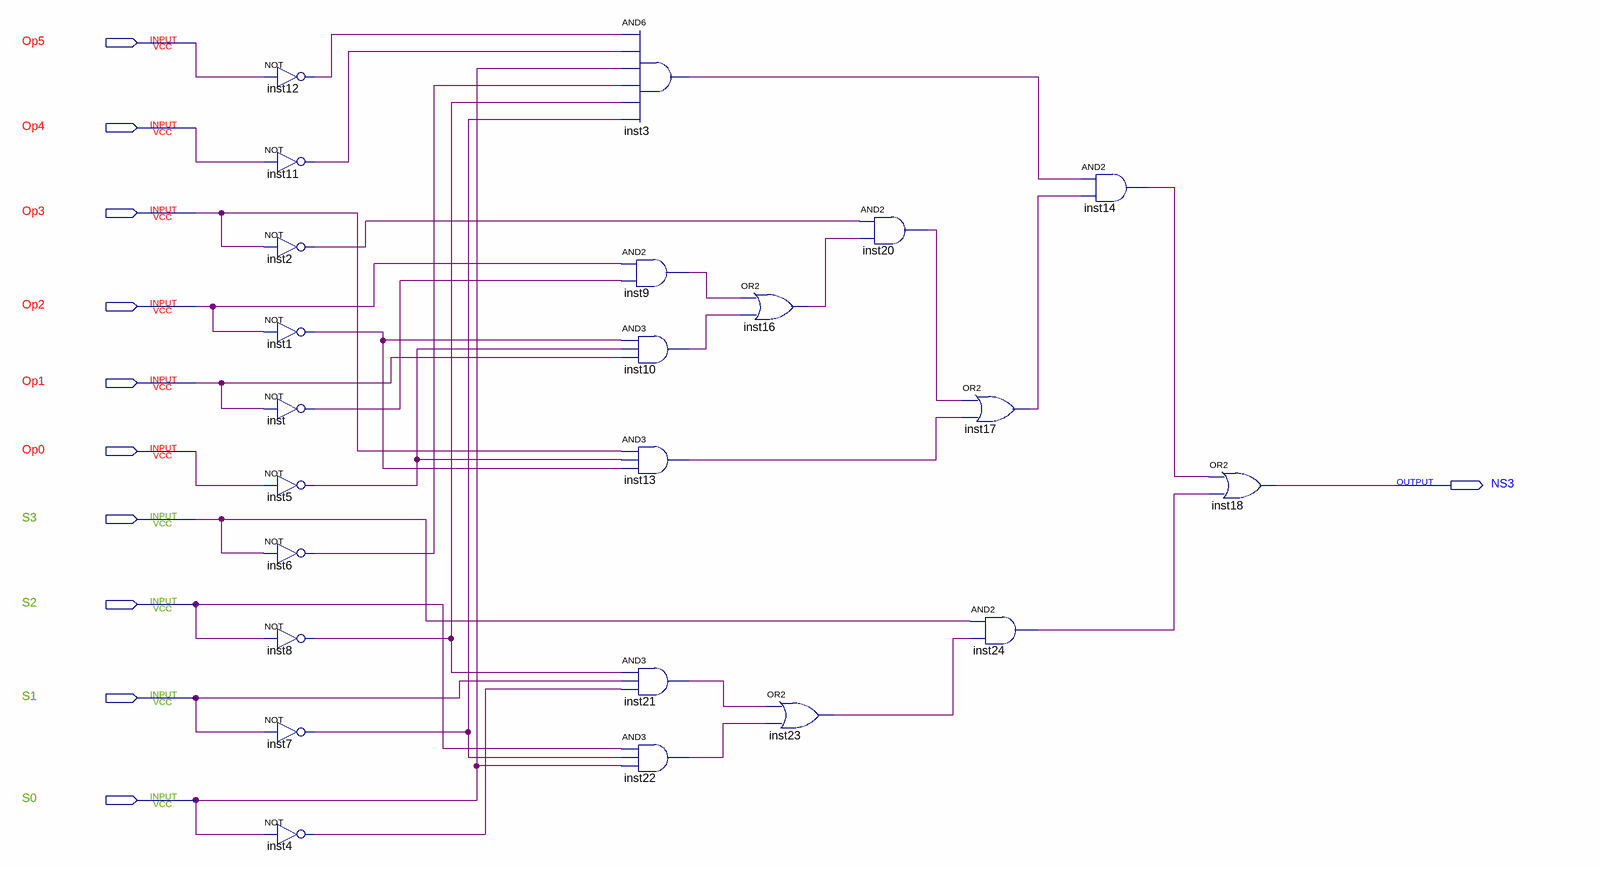
[diagram p0: schematic sheet]
// Quartus schematic NS3.bdf as structural Verilog: 23 symbols, 11 pins
module NS3 (
  input  Op5,
  input  Op4,
  input  Op3,
  input  Op2,
  input  Op1,
  input  Op0,
  input  S3,
  input  S2,
  input  S1,
  input  S0,
  output NS3
);

  wire inst1_out, inst2_out, inst3_out, inst4_out, inst5_out, inst6_out, inst7_out, inst8_out, inst9_out,
       inst10_out, inst11_out, inst12_out, inst13_out, inst14_out, inst16_out, inst17_out, inst20_out,
       inst21_out, inst22_out, inst23_out, inst24_out, inst_out;

  not inst12 (inst12_out, Op5);
  not inst11 (inst11_out, Op4);
  not inst2 (inst2_out, Op3);
  not inst1 (inst1_out, Op2);
  not inst (inst_out, Op1);
  not inst5 (inst5_out, Op0);
  not inst6 (inst6_out, S3);
  not inst8 (inst8_out, S2);
  not inst7 (inst7_out, S1);
  not inst4 (inst4_out, S0);
  and inst3 (inst3_out, inst12_out, inst11_out, S0, inst6_out, inst8_out, inst7_out);
  and inst9 (inst9_out, Op2, inst_out);
  and inst10 (inst10_out, inst1_out, inst5_out, Op1);
  and inst13 (inst13_out, Op3, inst5_out, inst1_out);
  and inst21 (inst21_out, inst8_out, S1, inst4_out);
  and inst22 (inst22_out, S2, inst7_out, S0);
  or inst16 (inst16_out, inst9_out, inst10_out);
  or inst23 (inst23_out, inst21_out, inst22_out);
  and inst20 (inst20_out, inst2_out, inst16_out);
  or inst17 (inst17_out, inst20_out, inst13_out);
  and inst24 (inst24_out, S3, inst23_out);
  and inst14 (inst14_out, inst3_out, inst17_out);
  or inst18 (NS3, inst14_out, inst24_out);
endmodule
